# EAGLE design v7-flex2811_16x (EAGLE 7.3.0)

## Sheet 1 of 16
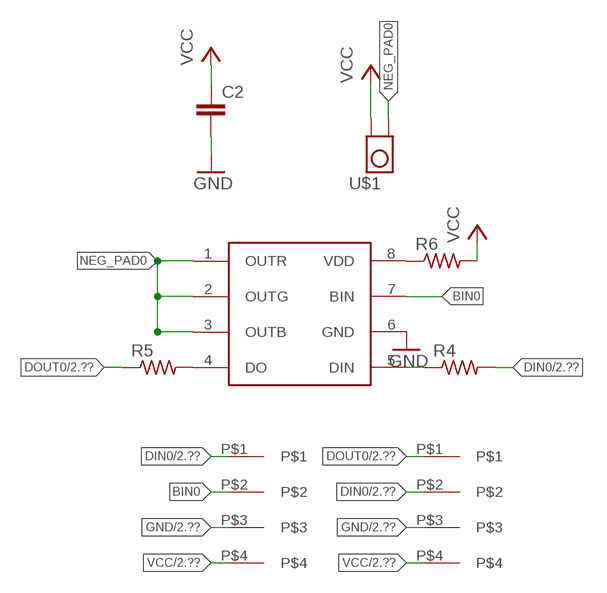
[diagram p0: schematic, sheet 1]

### Parts
C2  C-EUC0201  [C0201]
R4  R-US_R0201  [R0201]
R5  R-US_R0201  [R0201]
R6  R-US_R0201  [R0201]
U$1  TP_4MM_MED_PAD  [TP_4MM_MED_PAD]
U$2  WS2818  [SO08]
U$3  4PAD  [4PAD]
U$4  4PAD  [4PAD]

### Nets
BIN0: U$2.7(BIN) U$3.P$2
DIN0: R4.2 U$3.P$1 U$4.P$2 ; also sheet 2
DOUT0: R5.1 U$4.P$1 ; also sheet 2,3
GND: C2.2 U$2.6(GND) U$3.P$3 U$4.P$3 ; also sheet 2,3,4,5,6,7,8,9,10,11,12,13,14,15,16
N$4: R4.1 U$2.5(DIN)
N$5: R5.2 U$2.4(DO)
N$6: R6.1 U$2.8(VDD)
NEG_PAD0: U$1.P$1 U$2.1(OUTR) U$2.2(OUTG) U$2.3(OUTB)
VCC: C2.1 R6.2 U$1.P$2 U$3.P$4 U$4.P$4 ; also sheet 2,3,4,5,6,7,8,9,10,11,12,13,14,15,16

## Sheet 2 of 16
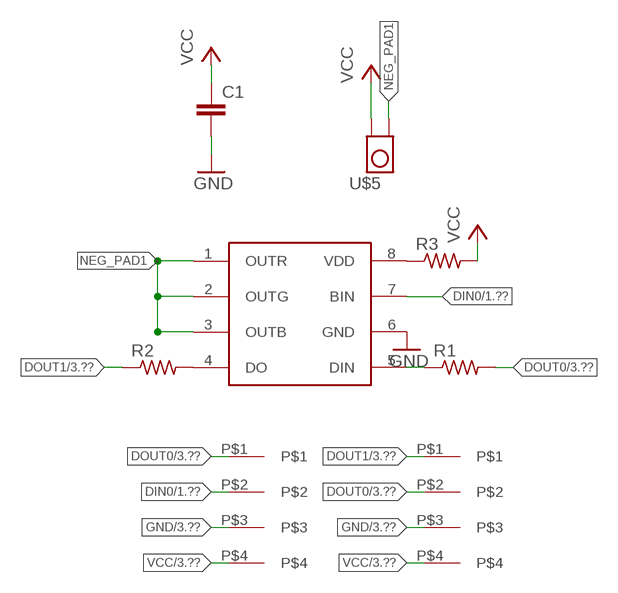
[diagram p1: schematic, sheet 2]

### Parts
C1  C-EUC0201  [C0201]
R1  R-US_R0201  [R0201]
R2  R-US_R0201  [R0201]
R3  R-US_R0201  [R0201]
U$5  TP_4MM_MED_PAD  [TP_4MM_MED_PAD]
U$6  WS2818  [SO08]
U$7  4PAD  [4PAD]
U$8  4PAD  [4PAD]

### Nets
DIN0: U$6.7(BIN) U$7.P$2 ; also sheet 1
DOUT0: R1.2 U$7.P$1 U$8.P$2 ; also sheet 1,3
DOUT1: R2.1 U$8.P$1 ; also sheet 3,4
GND: C1.2 U$6.6(GND) U$7.P$3 U$8.P$3 ; also sheet 1,3,4,5,6,7,8,9,10,11,12,13,14,15,16
N$1: R1.1 U$6.5(DIN)
N$2: R2.2 U$6.4(DO)
N$3: R3.1 U$6.8(VDD)
NEG_PAD1: U$5.P$1 U$6.1(OUTR) U$6.2(OUTG) U$6.3(OUTB)
VCC: C1.1 R3.2 U$5.P$2 U$7.P$4 U$8.P$4 ; also sheet 1,3,4,5,6,7,8,9,10,11,12,13,14,15,16

## Sheet 3 of 16
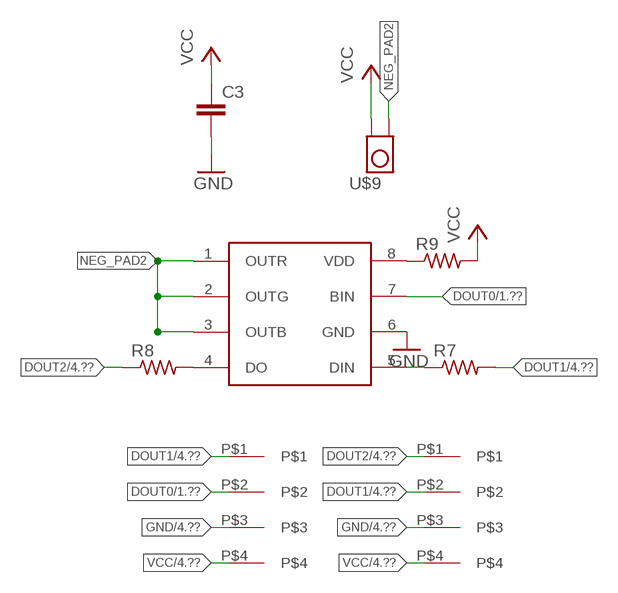
[diagram p2: schematic, sheet 3]

### Parts
C3  C-EUC0201  [C0201]
R7  R-US_R0201  [R0201]
R8  R-US_R0201  [R0201]
R9  R-US_R0201  [R0201]
U$9  TP_4MM_MED_PAD  [TP_4MM_MED_PAD]
U$10  WS2818  [SO08]
U$11  4PAD  [4PAD]
U$12  4PAD  [4PAD]

### Nets
DOUT0: U$10.7(BIN) U$11.P$2 ; also sheet 1,2
DOUT1: R7.2 U$11.P$1 U$12.P$2 ; also sheet 2,4
DOUT2: R8.1 U$12.P$1 ; also sheet 4,5
GND: C3.2 U$10.6(GND) U$11.P$3 U$12.P$3 ; also sheet 1,2,4,5,6,7,8,9,10,11,12,13,14,15,16
N$7: R7.1 U$10.5(DIN)
N$8: R8.2 U$10.4(DO)
N$9: R9.1 U$10.8(VDD)
NEG_PAD2: U$9.P$1 U$10.1(OUTR) U$10.2(OUTG) U$10.3(OUTB)
VCC: C3.1 R9.2 U$9.P$2 U$11.P$4 U$12.P$4 ; also sheet 1,2,4,5,6,7,8,9,10,11,12,13,14,15,16

## Sheet 4 of 16
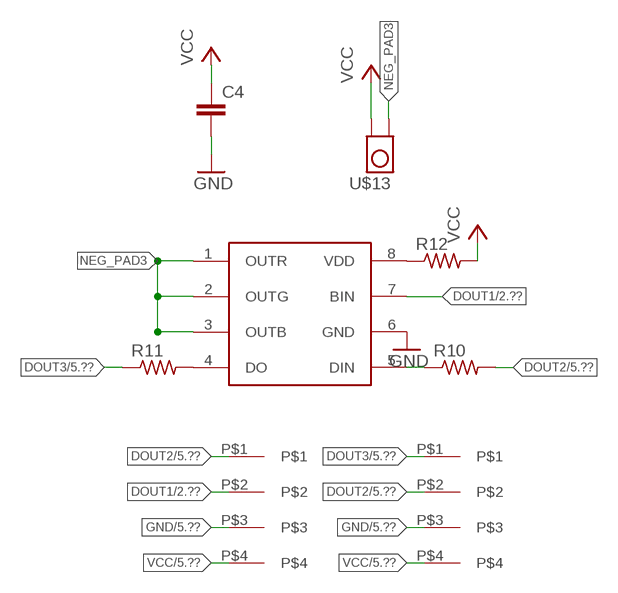
[diagram p3: schematic, sheet 4]

### Parts
C4  C-EUC0201  [C0201]
R10  R-US_R0201  [R0201]
R11  R-US_R0201  [R0201]
R12  R-US_R0201  [R0201]
U$13  TP_4MM_MED_PAD  [TP_4MM_MED_PAD]
U$14  WS2818  [SO08]
U$15  4PAD  [4PAD]
U$16  4PAD  [4PAD]

### Nets
DOUT1: U$14.7(BIN) U$15.P$2 ; also sheet 2,3
DOUT2: R10.2 U$15.P$1 U$16.P$2 ; also sheet 3,5
DOUT3: R11.1 U$16.P$1 ; also sheet 5,6
GND: C4.2 U$14.6(GND) U$15.P$3 U$16.P$3 ; also sheet 1,2,3,5,6,7,8,9,10,11,12,13,14,15,16
N$10: R10.1 U$14.5(DIN)
N$11: R11.2 U$14.4(DO)
N$12: R12.1 U$14.8(VDD)
NEG_PAD3: U$13.P$1 U$14.1(OUTR) U$14.2(OUTG) U$14.3(OUTB)
VCC: C4.1 R12.2 U$13.P$2 U$15.P$4 U$16.P$4 ; also sheet 1,2,3,5,6,7,8,9,10,11,12,13,14,15,16

## Sheet 5 of 16
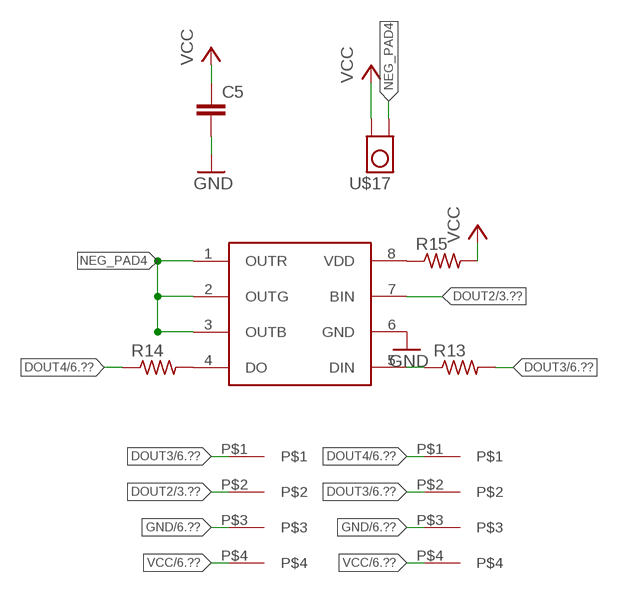
[diagram p4: schematic, sheet 5]

### Parts
C5  C-EUC0201  [C0201]
R13  R-US_R0201  [R0201]
R14  R-US_R0201  [R0201]
R15  R-US_R0201  [R0201]
U$17  TP_4MM_MED_PAD  [TP_4MM_MED_PAD]
U$18  WS2818  [SO08]
U$19  4PAD  [4PAD]
U$20  4PAD  [4PAD]

### Nets
DOUT2: U$18.7(BIN) U$19.P$2 ; also sheet 3,4
DOUT3: R13.2 U$19.P$1 U$20.P$2 ; also sheet 4,6
DOUT4: R14.1 U$20.P$1 ; also sheet 6,7
GND: C5.2 U$18.6(GND) U$19.P$3 U$20.P$3 ; also sheet 1,2,3,4,6,7,8,9,10,11,12,13,14,15,16
N$13: R13.1 U$18.5(DIN)
N$14: R14.2 U$18.4(DO)
N$15: R15.1 U$18.8(VDD)
NEG_PAD4: U$17.P$1 U$18.1(OUTR) U$18.2(OUTG) U$18.3(OUTB)
VCC: C5.1 R15.2 U$17.P$2 U$19.P$4 U$20.P$4 ; also sheet 1,2,3,4,6,7,8,9,10,11,12,13,14,15,16

## Sheet 6 of 16
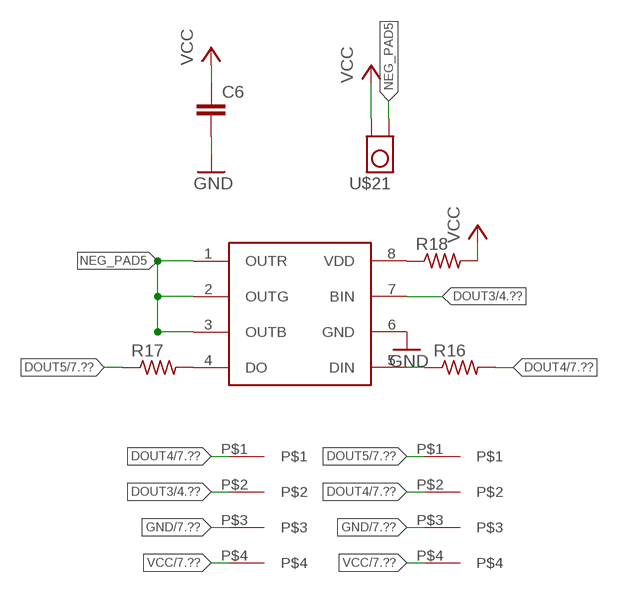
[diagram p5: schematic, sheet 6]

### Parts
C6  C-EUC0201  [C0201]
R16  R-US_R0201  [R0201]
R17  R-US_R0201  [R0201]
R18  R-US_R0201  [R0201]
U$21  TP_4MM_MED_PAD  [TP_4MM_MED_PAD]
U$22  WS2818  [SO08]
U$23  4PAD  [4PAD]
U$24  4PAD  [4PAD]

### Nets
DOUT3: U$22.7(BIN) U$23.P$2 ; also sheet 4,5
DOUT4: R16.2 U$23.P$1 U$24.P$2 ; also sheet 5,7
DOUT5: R17.1 U$24.P$1 ; also sheet 7,8
GND: C6.2 U$22.6(GND) U$23.P$3 U$24.P$3 ; also sheet 1,2,3,4,5,7,8,9,10,11,12,13,14,15,16
N$16: R16.1 U$22.5(DIN)
N$17: R17.2 U$22.4(DO)
N$18: R18.1 U$22.8(VDD)
NEG_PAD5: U$21.P$1 U$22.1(OUTR) U$22.2(OUTG) U$22.3(OUTB)
VCC: C6.1 R18.2 U$21.P$2 U$23.P$4 U$24.P$4 ; also sheet 1,2,3,4,5,7,8,9,10,11,12,13,14,15,16

## Sheet 7 of 16
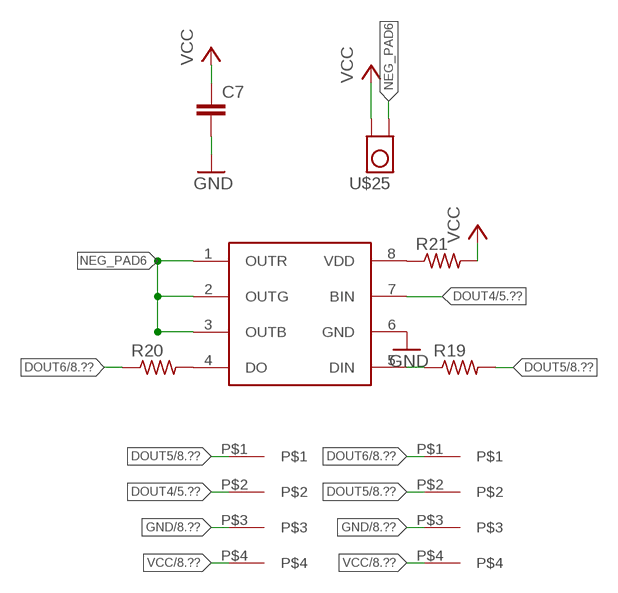
[diagram p6: schematic, sheet 7]

### Parts
C7  C-EUC0201  [C0201]
R19  R-US_R0201  [R0201]
R20  R-US_R0201  [R0201]
R21  R-US_R0201  [R0201]
U$25  TP_4MM_MED_PAD  [TP_4MM_MED_PAD]
U$26  WS2818  [SO08]
U$27  4PAD  [4PAD]
U$28  4PAD  [4PAD]

### Nets
DOUT4: U$26.7(BIN) U$27.P$2 ; also sheet 5,6
DOUT5: R19.2 U$27.P$1 U$28.P$2 ; also sheet 6,8
DOUT6: R20.1 U$28.P$1 ; also sheet 8,9
GND: C7.2 U$26.6(GND) U$27.P$3 U$28.P$3 ; also sheet 1,2,3,4,5,6,8,9,10,11,12,13,14,15,16
N$19: R19.1 U$26.5(DIN)
N$20: R20.2 U$26.4(DO)
N$21: R21.1 U$26.8(VDD)
NEG_PAD6: U$25.P$1 U$26.1(OUTR) U$26.2(OUTG) U$26.3(OUTB)
VCC: C7.1 R21.2 U$25.P$2 U$27.P$4 U$28.P$4 ; also sheet 1,2,3,4,5,6,8,9,10,11,12,13,14,15,16

## Sheet 8 of 16
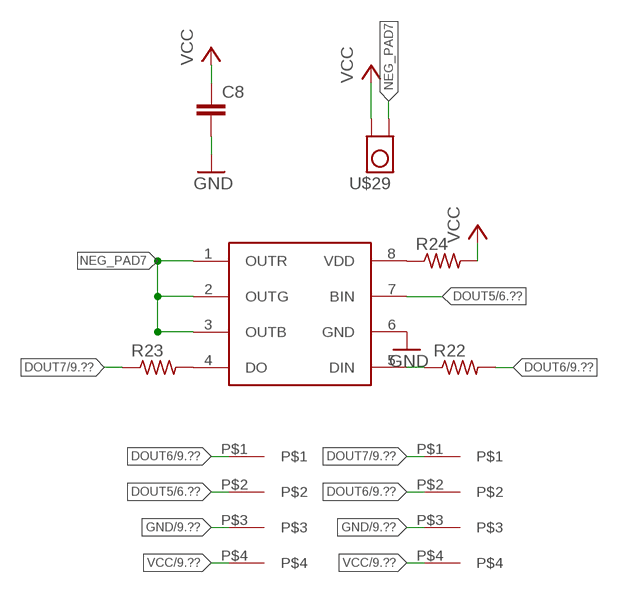
[diagram p7: schematic, sheet 8]

### Parts
C8  C-EUC0201  [C0201]
R22  R-US_R0201  [R0201]
R23  R-US_R0201  [R0201]
R24  R-US_R0201  [R0201]
U$29  TP_4MM_MED_PAD  [TP_4MM_MED_PAD]
U$30  WS2818  [SO08]
U$31  4PAD  [4PAD]
U$32  4PAD  [4PAD]

### Nets
DOUT5: U$30.7(BIN) U$31.P$2 ; also sheet 6,7
DOUT6: R22.2 U$31.P$1 U$32.P$2 ; also sheet 7,9
DOUT7: R23.1 U$32.P$1 ; also sheet 9,10
GND: C8.2 U$30.6(GND) U$31.P$3 U$32.P$3 ; also sheet 1,2,3,4,5,6,7,9,10,11,12,13,14,15,16
N$22: R22.1 U$30.5(DIN)
N$23: R23.2 U$30.4(DO)
N$24: R24.1 U$30.8(VDD)
NEG_PAD7: U$29.P$1 U$30.1(OUTR) U$30.2(OUTG) U$30.3(OUTB)
VCC: C8.1 R24.2 U$29.P$2 U$31.P$4 U$32.P$4 ; also sheet 1,2,3,4,5,6,7,9,10,11,12,13,14,15,16

## Sheet 9 of 16
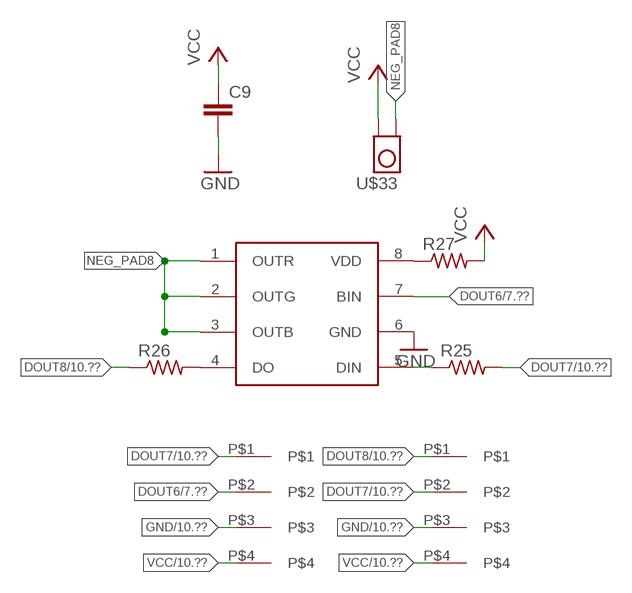
[diagram p8: schematic, sheet 9]

### Parts
C9  C-EUC0201  [C0201]
R25  R-US_R0201  [R0201]
R26  R-US_R0201  [R0201]
R27  R-US_R0201  [R0201]
U$33  TP_4MM_MED_PAD  [TP_4MM_MED_PAD]
U$34  WS2818  [SO08]
U$35  4PAD  [4PAD]
U$36  4PAD  [4PAD]

### Nets
DOUT6: U$34.7(BIN) U$35.P$2 ; also sheet 7,8
DOUT7: R25.2 U$35.P$1 U$36.P$2 ; also sheet 8,10
DOUT8: R26.1 U$36.P$1 ; also sheet 10,11
GND: C9.2 U$34.6(GND) U$35.P$3 U$36.P$3 ; also sheet 1,2,3,4,5,6,7,8,10,11,12,13,14,15,16
N$25: R25.1 U$34.5(DIN)
N$26: R26.2 U$34.4(DO)
N$27: R27.1 U$34.8(VDD)
NEG_PAD8: U$33.P$1 U$34.1(OUTR) U$34.2(OUTG) U$34.3(OUTB)
VCC: C9.1 R27.2 U$33.P$2 U$35.P$4 U$36.P$4 ; also sheet 1,2,3,4,5,6,7,8,10,11,12,13,14,15,16

## Sheet 10 of 16
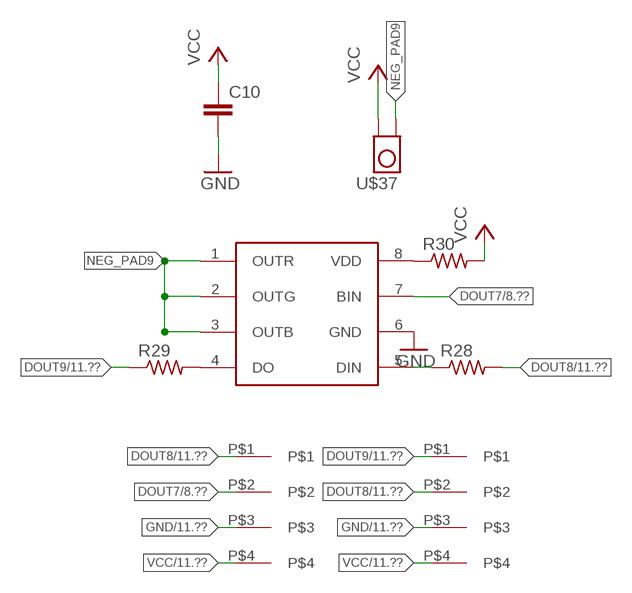
[diagram p9: schematic, sheet 10]

### Parts
C10  C-EUC0201  [C0201]
R28  R-US_R0201  [R0201]
R29  R-US_R0201  [R0201]
R30  R-US_R0201  [R0201]
U$37  TP_4MM_MED_PAD  [TP_4MM_MED_PAD]
U$38  WS2818  [SO08]
U$39  4PAD  [4PAD]
U$40  4PAD  [4PAD]

### Nets
DOUT7: U$38.7(BIN) U$39.P$2 ; also sheet 8,9
DOUT8: R28.2 U$39.P$1 U$40.P$2 ; also sheet 9,11
DOUT9: R29.1 U$40.P$1 ; also sheet 11,12
GND: C10.2 U$38.6(GND) U$39.P$3 U$40.P$3 ; also sheet 1,2,3,4,5,6,7,8,9,11,12,13,14,15,16
N$28: R28.1 U$38.5(DIN)
N$29: R29.2 U$38.4(DO)
N$30: R30.1 U$38.8(VDD)
NEG_PAD9: U$37.P$1 U$38.1(OUTR) U$38.2(OUTG) U$38.3(OUTB)
VCC: C10.1 R30.2 U$37.P$2 U$39.P$4 U$40.P$4 ; also sheet 1,2,3,4,5,6,7,8,9,11,12,13,14,15,16

## Sheet 11 of 16
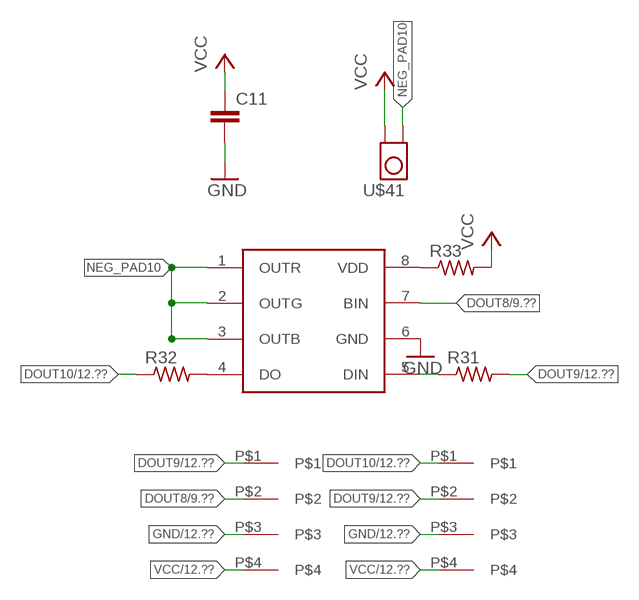
[diagram p10: schematic, sheet 11]

### Parts
C11  C-EUC0201  [C0201]
R31  R-US_R0201  [R0201]
R32  R-US_R0201  [R0201]
R33  R-US_R0201  [R0201]
U$41  TP_4MM_MED_PAD  [TP_4MM_MED_PAD]
U$42  WS2818  [SO08]
U$43  4PAD  [4PAD]
U$44  4PAD  [4PAD]

### Nets
DOUT8: U$42.7(BIN) U$43.P$2 ; also sheet 9,10
DOUT9: R31.2 U$43.P$1 U$44.P$2 ; also sheet 10,12
DOUT10: R32.1 U$44.P$1 ; also sheet 12,13
GND: C11.2 U$42.6(GND) U$43.P$3 U$44.P$3 ; also sheet 1,2,3,4,5,6,7,8,9,10,12,13,14,15,16
N$31: R31.1 U$42.5(DIN)
N$32: R32.2 U$42.4(DO)
N$33: R33.1 U$42.8(VDD)
NEG_PAD10: U$41.P$1 U$42.1(OUTR) U$42.2(OUTG) U$42.3(OUTB)
VCC: C11.1 R33.2 U$41.P$2 U$43.P$4 U$44.P$4 ; also sheet 1,2,3,4,5,6,7,8,9,10,12,13,14,15,16

## Sheet 12 of 16
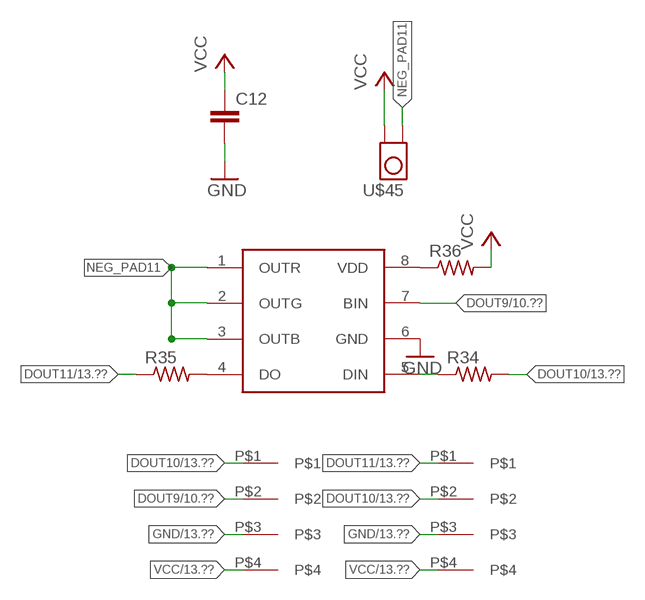
[diagram p11: schematic, sheet 12]

### Parts
C12  C-EUC0201  [C0201]
R34  R-US_R0201  [R0201]
R35  R-US_R0201  [R0201]
R36  R-US_R0201  [R0201]
U$45  TP_4MM_MED_PAD  [TP_4MM_MED_PAD]
U$46  WS2818  [SO08]
U$47  4PAD  [4PAD]
U$48  4PAD  [4PAD]

### Nets
DOUT9: U$46.7(BIN) U$47.P$2 ; also sheet 10,11
DOUT10: R34.2 U$47.P$1 U$48.P$2 ; also sheet 11,13
DOUT11: R35.1 U$48.P$1 ; also sheet 13,14
GND: C12.2 U$46.6(GND) U$47.P$3 U$48.P$3 ; also sheet 1,2,3,4,5,6,7,8,9,10,11,13,14,15,16
N$34: R34.1 U$46.5(DIN)
N$35: R35.2 U$46.4(DO)
N$36: R36.1 U$46.8(VDD)
NEG_PAD11: U$45.P$1 U$46.1(OUTR) U$46.2(OUTG) U$46.3(OUTB)
VCC: C12.1 R36.2 U$45.P$2 U$47.P$4 U$48.P$4 ; also sheet 1,2,3,4,5,6,7,8,9,10,11,13,14,15,16

## Sheet 13 of 16
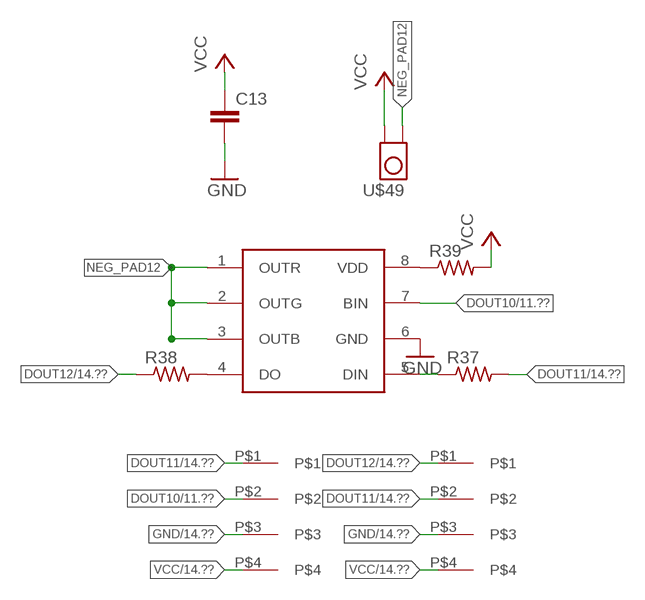
[diagram p12: schematic, sheet 13]

### Parts
C13  C-EUC0201  [C0201]
R37  R-US_R0201  [R0201]
R38  R-US_R0201  [R0201]
R39  R-US_R0201  [R0201]
U$49  TP_4MM_MED_PAD  [TP_4MM_MED_PAD]
U$50  WS2818  [SO08]
U$51  4PAD  [4PAD]
U$52  4PAD  [4PAD]

### Nets
DOUT10: U$50.7(BIN) U$51.P$2 ; also sheet 11,12
DOUT11: R37.2 U$51.P$1 U$52.P$2 ; also sheet 12,14
DOUT12: R38.1 U$52.P$1 ; also sheet 14,15
GND: C13.2 U$50.6(GND) U$51.P$3 U$52.P$3 ; also sheet 1,2,3,4,5,6,7,8,9,10,11,12,14,15,16
N$37: R37.1 U$50.5(DIN)
N$38: R38.2 U$50.4(DO)
N$39: R39.1 U$50.8(VDD)
NEG_PAD12: U$49.P$1 U$50.1(OUTR) U$50.2(OUTG) U$50.3(OUTB)
VCC: C13.1 R39.2 U$49.P$2 U$51.P$4 U$52.P$4 ; also sheet 1,2,3,4,5,6,7,8,9,10,11,12,14,15,16

## Sheet 14 of 16
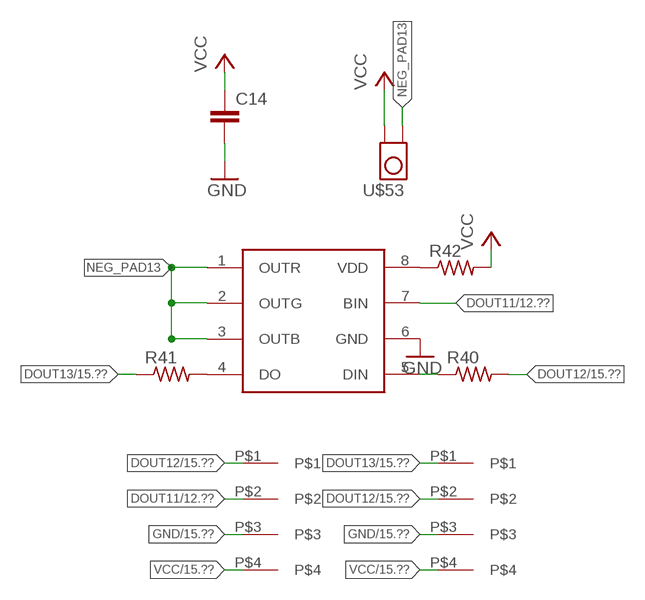
[diagram p13: schematic, sheet 14]

### Parts
C14  C-EUC0201  [C0201]
R40  R-US_R0201  [R0201]
R41  R-US_R0201  [R0201]
R42  R-US_R0201  [R0201]
U$53  TP_4MM_MED_PAD  [TP_4MM_MED_PAD]
U$54  WS2818  [SO08]
U$55  4PAD  [4PAD]
U$56  4PAD  [4PAD]

### Nets
DOUT11: U$54.7(BIN) U$55.P$2 ; also sheet 12,13
DOUT12: R40.2 U$55.P$1 U$56.P$2 ; also sheet 13,15
DOUT13: R41.1 U$56.P$1 ; also sheet 15,16
GND: C14.2 U$54.6(GND) U$55.P$3 U$56.P$3 ; also sheet 1,2,3,4,5,6,7,8,9,10,11,12,13,15,16
N$40: R40.1 U$54.5(DIN)
N$41: R41.2 U$54.4(DO)
N$42: R42.1 U$54.8(VDD)
NEG_PAD13: U$53.P$1 U$54.1(OUTR) U$54.2(OUTG) U$54.3(OUTB)
VCC: C14.1 R42.2 U$53.P$2 U$55.P$4 U$56.P$4 ; also sheet 1,2,3,4,5,6,7,8,9,10,11,12,13,15,16

## Sheet 15 of 16
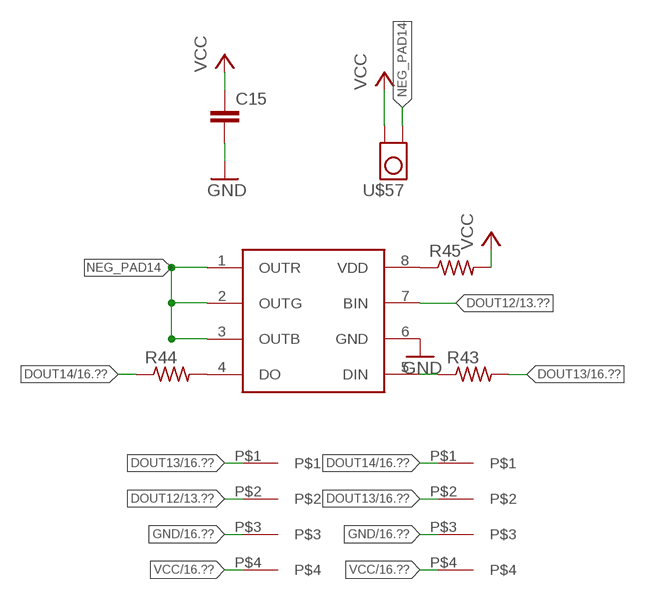
[diagram p14: schematic, sheet 15]

### Parts
C15  C-EUC0201  [C0201]
R43  R-US_R0201  [R0201]
R44  R-US_R0201  [R0201]
R45  R-US_R0201  [R0201]
U$57  TP_4MM_MED_PAD  [TP_4MM_MED_PAD]
U$58  WS2818  [SO08]
U$59  4PAD  [4PAD]
U$60  4PAD  [4PAD]

### Nets
DOUT12: U$58.7(BIN) U$59.P$2 ; also sheet 13,14
DOUT13: R43.2 U$59.P$1 U$60.P$2 ; also sheet 14,16
DOUT14: R44.1 U$60.P$1 ; also sheet 16
GND: C15.2 U$58.6(GND) U$59.P$3 U$60.P$3 ; also sheet 1,2,3,4,5,6,7,8,9,10,11,12,13,14,16
N$43: R43.1 U$58.5(DIN)
N$44: R44.2 U$58.4(DO)
N$45: R45.1 U$58.8(VDD)
NEG_PAD14: U$57.P$1 U$58.1(OUTR) U$58.2(OUTG) U$58.3(OUTB)
VCC: C15.1 R45.2 U$57.P$2 U$59.P$4 U$60.P$4 ; also sheet 1,2,3,4,5,6,7,8,9,10,11,12,13,14,16

## Sheet 16 of 16
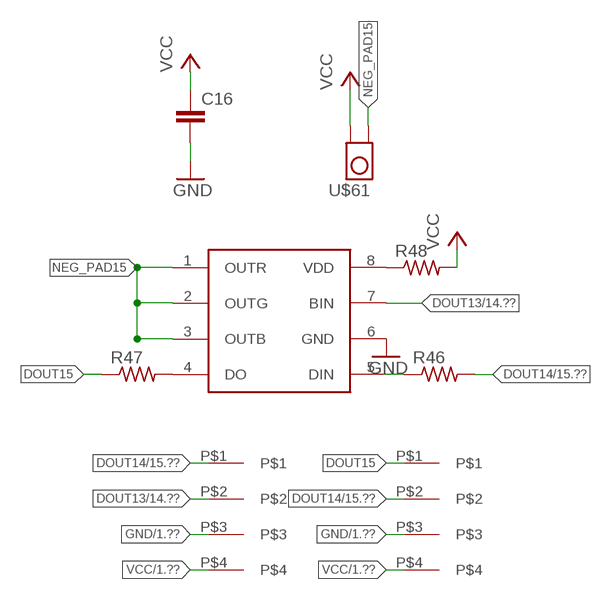
[diagram p15: schematic, sheet 16]

### Parts
C16  C-EUC0201  [C0201]
R46  R-US_R0201  [R0201]
R47  R-US_R0201  [R0201]
R48  R-US_R0201  [R0201]
U$61  TP_4MM_MED_PAD  [TP_4MM_MED_PAD]
U$62  WS2818  [SO08]
U$63  4PAD  [4PAD]
U$64  4PAD  [4PAD]

### Nets
DOUT13: U$62.7(BIN) U$63.P$2 ; also sheet 14,15
DOUT14: R46.2 U$63.P$1 U$64.P$2 ; also sheet 15
DOUT15: R47.1 U$64.P$1
GND: C16.2 U$62.6(GND) U$63.P$3 U$64.P$3 ; also sheet 1,2,3,4,5,6,7,8,9,10,11,12,13,14,15
N$46: R46.1 U$62.5(DIN)
N$47: R47.2 U$62.4(DO)
N$48: R48.1 U$62.8(VDD)
NEG_PAD15: U$61.P$1 U$62.1(OUTR) U$62.2(OUTG) U$62.3(OUTB)
VCC: C16.1 R48.2 U$61.P$2 U$63.P$4 U$64.P$4 ; also sheet 1,2,3,4,5,6,7,8,9,10,11,12,13,14,15

## Library data of the parts
C1-C16 = rcl:C-EU: CAPACITOR, European symbol
R1-R48 = rcl:R-US_: RESISTOR, American symbol
U$1 U$5 U$9 U$13 U$17 U$21 U$25 U$29 U$33 U$37 U$41 U$45 U$49 U$53 U$57 U$61 = tom-tappytap-v5-flex:TP_4MM_MED_PAD
U$2 U$6 U$10 U$14 U$18 U$22 U$26 U$30 U$34 U$38 U$42 U$46 U$50 U$54 U$58 U$62 = Sparky:WS2818
U$3 U$4 U$7 U$8 U$11 U$12 U$15 U$16 U$19 U$20 U$23 U$24 U$27 U$28 U$31 U$32 U$35 U$36 U$39 U$40 U$43 U$44 U$47 U$48 U$51 U$52 U$55 U$56 U$59 U$60 U$63 U$64 = Sparky:4PAD

## Board
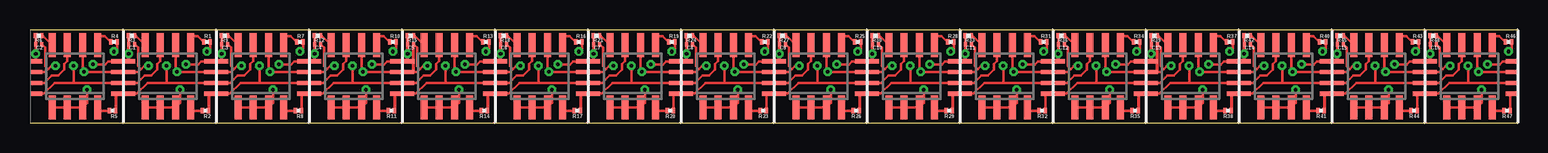
[diagram p16: board, top side]
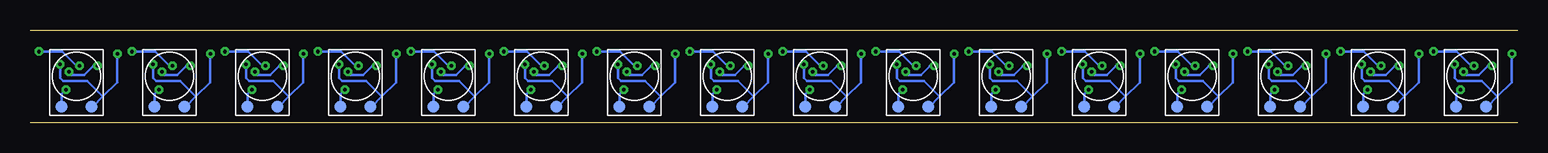
[diagram p17: board, bottom side, seen from below]

Size 124 x 7.75 mm. Coordinates in mm from the lower left corner, seen from the top.
Outline: 0,0 124,0
Outline: 124,7.75 0,7.75
Copper layers (1*16): Top 0.035mm / dielectric 1.5mm / Bottom 0.035mm
Design rules "default": minimum track width 10mil, minimum drill 24mil, track to track 8mil, track to pad 8mil, pad to pad 8mil, via to via 8mil, smd to smd 8mil, copper to edge 40mil, drill to drill 8mil, minimum pad ring 10mil, minimum via ring 8mil, stop-mask expansion 4mil, vias tented up to drill 0mil, thermal gap 10mil

### Footprints (pad centres in the part's own frame; a part is rotated, then mirrored left to right if it is on the bottom)
C0201 = smd 0.25 x 0.35: 1 -0.25,0; 2 0.25,0
R0201 = smd 0.28 x 0.43: 1 -0.255,0; 2 0.255,0
TP_4MM_MED_PAD = smd 1.016 x 1.016: P$1 -1.24,-2.55; P$2 1.24,-2.55
SO08 = smd 0.6 x 2: 1 -1.905,-2.6; 2 -0.635,-2.6; 3 0.635,-2.6; 4 1.905,-2.6; 5 1.905,2.6; 6 0.635,2.6; 7 -0.635,2.6; 8 -1.905,2.6
4PAD = smd 1 x 0.4: P$1 0,0.3 | smd 1 x 0.35: P$2 0,1.2; P$3 0,2.1; P$4 0,3

### Placement (x,y rotation side)
C1  8.47,6.55 0 top
C2  0.72,6.55 0 top
C3  16.23,6.55 0 top
C4  23.98,6.55 0 top
C5  31.73,6.55 0 top
C6  39.48,6.55 0 top
C7  47.23,6.55 0 top
C8  54.98,6.55 0 top
C9  62.73,6.55 0 top
C10  70.47,6.55 0 top
C11  78.22,6.55 0 top
C12  85.97,6.55 0 top
C13  93.72,6.55 0 top
C14  101.47,6.55 0 top
C15  109.22,6.55 0 top
C16  116.97,6.55 0 top
R1  14.75,6.75 0 top
R2  14.62,1 180 top
R3  8.47,7.28 180 top
R4  7,6.75 0 top
R5  6.88,1 180 top
R6  0.72,7.28 180 top
R7  22.5,6.75 0 top
R8  22.38,1 180 top
R9  16.23,7.28 180 top
R10  30.25,6.75 0 top
R11  30.12,1 180 top
R12  23.98,7.28 180 top
R13  38,6.75 0 top
R14  37.88,1 180 top
R15  31.73,7.28 180 top
R16  45.75,6.75 0 top
R17  45.62,1 180 top
R18  39.48,7.28 180 top
R19  53.5,6.75 0 top
R20  53.38,1 180 top
R21  47.23,7.28 180 top
R22  61.25,6.75 0 top
R23  61.12,1 180 top
R24  54.98,7.28 180 top
R25  69,6.75 0 top
R26  68.88,1 180 top
R27  62.73,7.28 180 top
R28  76.75,6.75 0 top
R29  76.62,1 180 top
R30  70.47,7.28 180 top
R31  84.5,6.75 0 top
R32  84.38,1 180 top
R33  78.22,7.28 180 top
R34  92.25,6.75 0 top
R35  92.12,1 180 top
R36  85.97,7.28 180 top
R37  100,6.75 0 top
R38  99.88,1 180 top
R39  93.72,7.28 180 top
R40  107.75,6.75 0 top
R41  107.62,1 180 top
R42  101.47,7.28 180 top
R43  115.5,6.75 0 top
R44  115.38,1 180 top
R45  109.22,7.28 180 top
R46  123.25,6.75 0 top
R47  123.12,1 180 top
R48  116.97,7.28 180 top
U$1  3.88,3.88 0 bottom
U$2  3.75,3.88 0 top
U$3  0.5,2.12 0 top
U$4  7.25,2.12 0 top
U$5  11.62,3.88 0 bottom
U$6  11.5,3.88 0 top
U$7  8.25,2.12 0 top
U$8  15,2.12 0 top
U$9  19.38,3.88 0 bottom
U$10  19.25,3.88 0 top
U$11  16,2.12 0 top
U$12  22.75,2.12 0 top
U$13  27.12,3.88 0 bottom
U$14  27,3.88 0 top
U$15  23.75,2.12 0 top
U$16  30.5,2.12 0 top
U$17  34.88,3.88 0 bottom
U$18  34.75,3.88 0 top
U$19  31.5,2.12 0 top
U$20  38.25,2.12 0 top
U$21  42.62,3.88 0 bottom
U$22  42.5,3.88 0 top
U$23  39.25,2.12 0 top
U$24  46,2.12 0 top
U$25  50.38,3.88 0 bottom
U$26  50.25,3.88 0 top
U$27  47,2.12 0 top
U$28  53.75,2.12 0 top
U$29  58.12,3.88 0 bottom
U$30  58,3.88 0 top
U$31  54.75,2.12 0 top
U$32  61.5,2.12 0 top
U$33  65.88,3.88 0 bottom
U$34  65.75,3.88 0 top
U$35  62.5,2.12 0 top
U$36  69.25,2.12 0 top
U$37  73.62,3.88 0 bottom
U$38  73.5,3.88 0 top
U$39  70.25,2.12 0 top
U$40  77,2.12 0 top
U$41  81.38,3.88 0 bottom
U$42  81.25,3.88 0 top
U$43  78,2.12 0 top
U$44  84.75,2.12 0 top
U$45  89.12,3.88 0 bottom
U$46  89,3.88 0 top
U$47  85.75,2.12 0 top
U$48  92.5,2.12 0 top
U$49  96.88,3.88 0 bottom
U$50  96.75,3.88 0 top
U$51  93.5,2.12 0 top
U$52  100.25,2.12 0 top
U$53  104.62,3.88 0 bottom
U$54  104.5,3.88 0 top
U$55  101.25,2.12 0 top
U$56  108,2.12 0 top
U$57  112.38,3.88 0 bottom
U$58  112.25,3.88 0 top
U$59  109,2.12 0 top
U$60  115.75,2.12 0 top
U$61  120.12,3.88 0 bottom
U$62  120,3.88 0 top
U$63  116.75,2.12 0 top
U$64  123.5,2.12 0 top

### Tracks (layer width: path | path; a pad name or v marks a point on that pad's centre or on a via)
BIN0
  Top 0.2: U$3.P$2 1.2,3.33 1.8,3.93 2.35,3.93 2.87,4.45 2.87,4.89 3.12,5.13 U$2.7
DIN0  (via drill 0.3)
  Top 0.2: 3.62,3.33 v3.62,4.75 | R4.2 7.25,6.2 v7,5.94 | U$3.P$1 1.17,2.42 2.06,3.33 3.62,3.33 | 3.62,3.33 U$4.P$2 | U$7.P$2 8.95,3.33 9.55,3.93 10.1,3.93 10.62,4.45 10.62,4.89 10.87,5.13 U$6.7
  Top 0.254: U$7.P$2 U$4.P$2
  Bottom 0.2: v3.62,4.75 3.88,4.75 5.07,5.94 v7,5.94
DOUT0  (via drill 0.3)
  Top 0.2: R5.1 7.13,2.31 U$4.P$1 | 11.38,3.33 v11.38,4.75 | R1.2 15.01,6.2 v14.75,5.94 | U$7.P$1 8.91,2.42 9.81,3.33 11.38,3.33 | 11.38,3.33 U$8.P$2 | U$11.P$2 16.7,3.33 17.3,3.93 17.85,3.93 18.37,4.45 18.37,4.89 18.61,5.13 U$10.7 18.62,6.46
  Top 0.254: U$7.P$1 7.13,2.42 R5.1 | U$11.P$2 U$8.P$2
  Bottom 0.2: v11.38,4.75 11.62,4.75 12.81,5.94 v14.75,5.94
DOUT1  (via drill 0.3)
  Top 0.2: R2.1 14.88,2.31 U$8.P$1 | 19.12,3.33 v19.12,4.75 | R7.2 22.75,6.2 v22.5,5.94 | U$11.P$1 16.66,2.42 17.57,3.33 19.12,3.33 | 19.12,3.33 U$12.P$2 | U$15.P$2 24.45,3.33 25.05,3.93 25.6,3.93 26.12,4.45 26.12,4.89 26.36,5.13 U$14.7 26.38,6.46
  Top 0.254: U$11.P$1 14.88,2.42 R2.1 | U$15.P$2 U$12.P$2
  Bottom 0.2: v19.12,4.75 19.38,4.75 20.57,5.94 v22.5,5.94
DOUT2  (via drill 0.3)
  Top 0.2: R8.1 22.63,2.31 U$12.P$1 | 26.88,3.33 v26.88,4.75 | R10.2 30.5,6.2 v30.25,5.94 | U$15.P$1 24.41,2.42 25.32,3.33 26.88,3.33 | 26.88,3.33 U$16.P$2 | U$19.P$2 32.2,3.33 32.8,3.93 33.35,3.93 33.87,4.45 33.87,4.89 34.12,5.13 U$18.7
  Top 0.254: U$12.P$1 U$15.P$1 | U$16.P$2 U$19.P$2
  Bottom 0.2: v26.88,4.75 27.12,4.75 28.32,5.94 v30.25,5.94
DOUT3  (via drill 0.3)
  Top 0.2: R11.1 30.38,2.31 U$16.P$1 | 34.62,3.33 v34.62,4.75 | R13.2 38.26,6.2 v38,5.94 | U$19.P$1 32.16,2.42 33.06,3.33 34.62,3.33 | 34.62,3.33 U$20.P$2 | U$23.P$2 39.95,3.33 40.55,3.93 41.1,3.93 41.62,4.45 41.62,4.89 41.87,5.13 U$22.7
  Top 0.254: U$23.P$2 U$20.P$2 | U$19.P$1 30.38,2.42 R11.1
  Bottom 0.2: v34.62,4.75 34.88,4.75 36.06,5.94 v38,5.94
DOUT4  (via drill 0.3)
  Top 0.2: R14.1 38.13,2.31 U$20.P$1 | 42.38,3.33 v42.38,4.75 | R16.2 46.01,6.2 v45.75,5.94 | U$23.P$1 39.91,2.42 40.81,3.33 42.38,3.33 | 42.38,3.33 U$24.P$2 | U$27.P$2 47.7,3.33 48.3,3.93 48.85,3.93 49.37,4.45 49.37,4.89 49.62,5.13 U$26.7
  Top 0.254: U$23.P$1 38.13,2.42 R14.1 | U$27.P$2 U$24.P$2
  Bottom 0.2: v42.38,4.75 42.62,4.75 43.81,5.94 v45.75,5.94
DOUT5  (via drill 0.3)
  Top 0.2: R17.1 45.88,2.31 U$24.P$1 | 50.12,3.33 v50.12,4.75 | R19.2 53.76,6.2 v53.5,5.94 | U$27.P$1 47.66,2.42 48.56,3.33 50.12,3.33 | 50.12,3.33 U$28.P$2 | U$31.P$2 55.45,3.33 56.05,3.93 56.6,3.93 57.12,4.45 57.12,4.89 57.37,5.13 U$30.7
  Top 0.254: U$27.P$1 45.88,2.42 R17.1 | U$31.P$2 U$28.P$2
  Bottom 0.2: v50.12,4.75 50.38,4.75 51.56,5.94 v53.5,5.94
DOUT6  (via drill 0.3)
  Top 0.2: R20.1 53.63,2.31 U$28.P$1 | 57.88,3.33 v57.88,4.75 | R22.2 61.51,6.2 v61.25,5.94 | U$31.P$1 55.41,2.42 56.31,3.33 57.88,3.33 | 57.88,3.33 U$32.P$2 | U$35.P$2 63.2,3.33 63.8,3.93 64.35,3.93 64.87,4.45 64.87,4.89 65.11,5.13 U$34.7 65.12,6.46
  Top 0.254: U$28.P$1 U$31.P$1 | U$32.P$2 U$35.P$2
  Bottom 0.2: v57.88,4.75 58.12,4.75 59.31,5.94 v61.25,5.94
DOUT7  (via drill 0.3)
  Top 0.2: R23.1 61.38,2.31 U$32.P$1 | 65.62,3.33 v65.62,4.75 | R25.2 69.25,6.2 v69,5.94 | U$35.P$1 63.16,2.42 64.06,3.33 65.62,3.33 | 65.62,3.33 U$36.P$2 | U$39.P$2 70.95,3.33 71.56,3.93 72.1,3.93 72.62,4.45 72.62,4.89 72.86,5.13 U$38.7 72.88,6.46
  Top 0.254: U$39.P$2 U$36.P$2 | U$32.P$1 U$35.P$1
  Bottom 0.2: v65.62,4.75 65.88,4.75 67.06,5.94 v69,5.94
DOUT8  (via drill 0.3)
  Top 0.2: R26.1 69.13,2.31 U$36.P$1 | 73.38,3.33 v73.38,4.75 | R28.2 77,6.2 v76.75,5.94 | U$39.P$1 70.92,2.42 71.81,3.33 73.38,3.33 | 73.38,3.33 U$40.P$2 | U$43.P$2 78.7,3.33 79.31,3.93 79.85,3.93 80.37,4.45 80.37,4.89 80.61,5.13 U$42.7 80.62,6.46
  Top 0.254: U$39.P$1 69.13,2.42 R26.1 | U$43.P$2 U$40.P$2
  Bottom 0.2: v73.38,4.75 73.62,4.75 74.81,5.94 v76.75,5.94
DOUT9  (via drill 0.3)
  Top 0.2: R29.1 76.88,2.31 U$40.P$1 | 81.12,3.33 v81.12,4.75 | R31.2 84.75,6.2 v84.5,5.94 | U$43.P$1 78.67,2.42 79.56,3.33 81.12,3.33 | 81.12,3.33 U$44.P$2 | U$47.P$2 86.45,3.33 87.06,3.93 87.6,3.93 88.12,4.45 88.12,4.89 88.36,5.13 U$46.7 88.38,6.46
  Top 0.254: U$43.P$1 76.88,2.42 R29.1 | U$47.P$2 U$44.P$2
  Bottom 0.2: v81.12,4.75 81.38,4.75 82.56,5.94 v84.5,5.94
DOUT10  (via drill 0.3)
  Top 0.2: R32.1 84.63,2.31 U$44.P$1 | 88.88,3.33 v88.88,4.75 | R34.2 92.5,6.2 v92.25,5.94 | U$47.P$1 86.42,2.42 87.31,3.33 88.88,3.33 | 88.88,3.33 U$48.P$2 | U$51.P$2 94.2,3.33 94.81,3.93 95.35,3.93 95.87,4.45 95.87,4.89 96.11,5.13 U$50.7 96.12,6.46
  Top 0.254: U$44.P$1 U$47.P$1 | U$48.P$2 U$51.P$2
  Bottom 0.2: v88.88,4.75 89.12,4.75 90.31,5.94 v92.25,5.94
DOUT11  (via drill 0.3)
  Top 0.2: R35.1 92.38,2.31 U$48.P$1 | 96.62,3.33 v96.62,4.75 | R37.2 100.25,6.2 v100,5.94 | U$51.P$1 94.17,2.42 95.06,3.33 96.62,3.33 | 96.62,3.33 U$52.P$2 | U$55.P$2 101.95,3.33 102.56,3.93 103.1,3.93 103.62,4.45 103.62,4.89 103.86,5.13 U$54.7 103.88,6.46
  Top 0.254: U$55.P$2 U$52.P$2 | U$51.P$1 92.38,2.42 R35.1
  Bottom 0.2: v96.62,4.75 96.88,4.75 98.06,5.94 v100,5.94
DOUT12  (via drill 0.3)
  Top 0.2: R38.1 100.13,2.31 U$52.P$1 | 104.38,3.33 v104.38,4.75 | R40.2 108,6.2 v107.75,5.94 | U$55.P$1 101.92,2.42 102.81,3.33 104.38,3.33 | 104.38,3.33 U$56.P$2 | U$59.P$2 109.7,3.33 110.31,3.93 110.85,3.93 111.37,4.45 111.37,4.89 111.61,5.13 U$58.7 111.62,6.46
  Top 0.254: U$55.P$1 100.13,2.42 R38.1 | U$59.P$2 U$56.P$2
  Bottom 0.2: v104.38,4.75 104.62,4.75 105.81,5.94 v107.75,5.94
DOUT13  (via drill 0.3)
  Top 0.2: R41.1 107.88,2.31 U$56.P$1 | 112.12,3.33 v112.12,4.75 | R43.2 115.75,6.2 v115.5,5.94 | U$59.P$1 109.67,2.42 110.56,3.33 112.12,3.33 | 112.12,3.33 U$60.P$2 | U$63.P$2 117.45,3.33 118.06,3.93 118.6,3.93 119.12,4.45 119.12,4.89 119.36,5.13 U$62.7 119.38,6.46
  Top 0.254: U$59.P$1 107.88,2.42 R41.1 | U$63.P$2 U$60.P$2
  Bottom 0.2: v112.12,4.75 112.38,4.75 113.56,5.94 v115.5,5.94
DOUT14  (via drill 0.3)
  Top 0.2: R44.1 115.63,2.31 U$60.P$1 | 119.88,3.33 v119.88,4.75 | R46.2 123.5,6.2 v123.25,5.94 | U$63.P$1 117.42,2.42 118.31,3.33 119.88,3.33 | 119.88,3.33 U$64.P$2
  Top 0.254: U$60.P$1 U$63.P$1
  Bottom 0.2: v119.88,4.75 120.12,4.75 121.31,5.94 v123.25,5.94
DOUT15
  Top 0.2: R47.1 123.38,2.31 U$64.P$1
GND  (via drill 0.3)
  Top 0.2: U$2.6 4.38,4.37 v4.5,4.25 4.53,4.22 U$4.P$3 7.22,4.25 | U$3.P$3 0.85,4.22 0.88,4.25 1.25,4.25 1.5,4.5 | 1.5,4.5 1.75,4.75 v2.12,4.75 | 1.5,4.5 1.27,4.73 1.27,6.25 C2.2 | U$6.6 12.13,4.37 v12.25,4.25 12.28,4.22 U$8.P$3 14.97,4.25 | U$7.P$3 8.6,4.22 8.62,4.25 9,4.25 9.25,4.5 | 9.25,4.5 9.5,4.75 v9.88,4.75 | 9.25,4.5 9.02,4.73 9.02,6.25 C1.2 | U$10.6 19.89,4.37 v20,4.25 20.02,4.22 U$12.P$3 22.73,4.25 | U$11.P$3 16.35,4.22 16.38,4.25 16.75,4.25 17,4.5 | 17,4.5 17.25,4.75 v17.62,4.75 | 17,4.5 16.77,4.73 16.77,6.25 C3.2 | U$14.6 27.64,4.37 v27.75,4.25 27.77,4.22 U$16.P$3 30.48,4.25 | U$15.P$3 24.1,4.22 24.12,4.25 24.5,4.25 24.75,4.5 | 24.75,4.5 25,4.75 v25.38,4.75 | 24.75,4.5 24.52,4.73 24.52,6.25 C4.2 | U$18.6 35.38,4.37 v35.5,4.25 35.52,4.22 U$20.P$3 38.23,4.25 | U$19.P$3 31.85,4.22 31.88,4.25 32.25,4.25 32.5,4.5 | 32.5,4.5 32.75,4.75 v33.12,4.75 | 32.5,4.5 32.27,4.73 32.27,6.25 C5.2 | U$22.6 43.13,4.37 v43.25,4.25 43.27,4.22 U$24.P$3 45.98,4.25 | U$23.P$3 39.6,4.22 39.62,4.25 40,4.25 40.25,4.5 | 40.25,4.5 40.5,4.75 v40.88,4.75 | 40.25,4.5 40.02,4.73 40.02,6.25 C6.2 | U$26.6 50.88,4.37 v51,4.25 51.02,4.22 U$28.P$3 53.73,4.25 | U$27.P$3 47.35,4.22 47.38,4.25 47.75,4.25 48,4.5 | 48,4.5 48.25,4.75 v48.62,4.75 | 48,4.5 47.77,4.73 47.77,6.25 C7.2 | U$30.6 58.63,4.37 v58.75,4.25 58.77,4.22 U$32.P$3 61.48,4.25 | U$31.P$3 55.1,4.22 55.12,4.25 55.5,4.25 55.75,4.5 | 55.75,4.5 56,4.75 v56.38,4.75 | 55.75,4.5 55.52,4.73 55.52,6.25 C8.2 | U$34.6 66.39,4.37 v66.5,4.25 66.53,4.22 U$36.P$3 69.22,4.25 | U$35.P$3 62.85,4.22 62.88,4.25 63.25,4.25 63.5,4.5 | 63.5,4.5 63.75,4.75 v64.12,4.75 | 63.5,4.5 63.27,4.73 63.27,6.25 C9.2
  Top 0.2: U$38.6 74.14,4.37 v74.25,4.25 74.28,4.22 U$40.P$3 76.97,4.25 | U$39.P$3 70.6,4.22 70.62,4.25 71,4.25 71.25,4.5 | 71.25,4.5 71.5,4.75 v71.88,4.75 | 71.25,4.5 71.02,4.73 71.02,6.25 C10.2 | U$42.6 81.89,4.37 v82,4.25 82.03,4.22 U$44.P$3 84.72,4.25 | U$43.P$3 78.35,4.22 78.38,4.25 78.75,4.25 79,4.5 | 79,4.5 79.25,4.75 v79.62,4.75 | 79,4.5 78.77,4.73 78.77,6.25 C11.2 | U$46.6 89.64,4.37 v89.75,4.25 89.78,4.22 U$48.P$3 92.47,4.25 | U$47.P$3 86.1,4.22 86.12,4.25 86.5,4.25 86.75,4.5 | 86.75,4.5 87,4.75 v87.38,4.75 | 86.75,4.5 86.52,4.73 86.52,6.25 C12.2 | U$50.6 97.39,4.37 v97.5,4.25 97.53,4.22 U$52.P$3 100.22,4.25 | U$51.P$3 93.85,4.22 93.88,4.25 94.25,4.25 94.5,4.5 | 94.5,4.5 94.75,4.75 v95.12,4.75 | 94.5,4.5 94.27,4.73 94.27,6.25 C13.2 | U$54.6 105.14,4.37 v105.25,4.25 105.28,4.22 U$56.P$3 107.97,4.25 | U$55.P$3 101.6,4.22 101.62,4.25 102,4.25 102.25,4.5 | 102.25,4.5 102.5,4.75 v102.88,4.75 | 102.25,4.5 102.02,4.73 102.02,6.25 C14.2 | U$58.6 112.89,4.37 v113,4.25 113.03,4.22 U$60.P$3 115.72,4.25 | U$59.P$3 109.35,4.22 109.38,4.25 109.75,4.25 110,4.5 | 110,4.5 110.25,4.75 v110.62,4.75 | 110,4.5 109.77,4.73 109.77,6.25 C15.2 | U$62.6 120.64,4.37 v120.75,4.25 120.78,4.22 U$64.P$3 123.47,4.25 | U$63.P$3 117.1,4.22 117.12,4.25 117.5,4.25 117.75,4.5 | 117.75,4.5 118,4.75 v118.38,4.75 | 117.75,4.5 117.52,4.73 117.52,6.25 C16.2
  Top 0.254: U$7.P$3 U$4.P$3 | U$11.P$3 U$8.P$3 | U$15.P$3 U$12.P$3 | U$23.P$3 U$20.P$3 | U$27.P$3 U$24.P$3 | U$31.P$3 U$28.P$3 | U$16.P$3 31.98,4.22 C5.2 | U$39.P$3 U$36.P$3 | U$43.P$3 U$40.P$3 | U$47.P$3 U$44.P$3 | U$55.P$3 U$52.P$3 | U$59.P$3 U$56.P$3 | U$63.P$3 U$60.P$3 | U$48.P$3 93.97,4.22 C13.2 | U$35.P$3 U$32.P$3
  Bottom 0.2: v4.5,4.25 4.5,4 3.25,4 2.5,4.75 v2.12,4.75 | v12.25,4.25 12.25,4 11,4 10.25,4.75 v9.88,4.75 | v20,4.25 20,4 18.75,4 18,4.75 v17.62,4.75 | v27.75,4.25 27.75,4 26.5,4 25.75,4.75 v25.38,4.75 | v35.5,4.25 35.5,4 34.25,4 33.5,4.75 v33.12,4.75 | v43.25,4.25 43.25,4 42,4 41.25,4.75 v40.88,4.75 | v51,4.25 51,4 49.75,4 49,4.75 v48.62,4.75 | v58.75,4.25 58.75,4 57.5,4 56.75,4.75 v56.38,4.75 | v66.5,4.25 66.5,4 65.25,4 64.5,4.75 v64.12,4.75 | v74.25,4.25 74.25,4 73,4 72.25,4.75 v71.88,4.75 | v82,4.25 82,4 80.75,4 80,4.75 v79.62,4.75 | v89.75,4.25 89.75,4 88.5,4 87.75,4.75 v87.38,4.75 | v97.5,4.25 97.5,4 96.25,4 95.5,4.75 v95.12,4.75 | v105.25,4.25 105.25,4 104,4 103.25,4.75 v102.88,4.75 | v113,4.25 113,4 111.75,4 111,4.75 v110.62,4.75 | v120.75,4.25 120.75,4 119.5,4 118.75,4.75 v118.38,4.75
N$1
  Top 0.2: 13.4,6.78 U$6.5 13.38,6.5 13.38,7 13.62,7.25 13.99,7.25 R1.1
N$2
  Top 0.2: U$6.4 13.68,1 R2.2
N$3
  Top 0.2: 9.6,6.78 U$6.8 8.79,7.28 R3.1
N$4
  Top 0.2: 5.66,6.78 U$2.5 5.62,6.5 5.62,7 5.88,7.25 6.25,7.25 R4.1
N$5
  Top 0.2: U$2.4 5.93,1 R5.2
N$6
  Top 0.2: 1.84,6.78 U$2.8 1.04,7.28 R6.1
N$7
  Top 0.2: 21.16,6.78 U$10.5 21.12,6.5 21.12,7 21.38,7.25 21.75,7.25 R7.1
N$8
  Top 0.2: U$10.4 21.43,1 R8.2
N$9
  Top 0.2: 17.34,6.78 U$10.8 16.55,7.28 R9.1
N$10
  Top 0.2: 28.91,6.78 U$14.5 28.88,6.5 28.88,7 29.12,7.25 29.5,7.25 R10.1
N$11
  Top 0.2: U$14.4 29.18,1 R11.2
N$12
  Top 0.2: 25.09,6.78 U$14.8 24.3,7.28 R12.1
N$13
  Top 0.2: 36.66,6.78 U$18.5 36.62,6.5 36.62,7 36.88,7.25 37.24,7.25 R13.1
N$14
  Top 0.2: U$18.4 36.93,1 R14.2
N$15
  Top 0.2: 32.84,6.78 U$18.8 32.05,7.28 R15.1
N$16
  Top 0.2: 44.41,6.78 U$22.5 44.38,6.5 44.38,7 44.62,7.25 44.99,7.25 R16.1
N$17
  Top 0.2: U$22.4 44.68,1 R17.2
N$18
  Top 0.2: 40.59,6.78 U$22.8 39.8,7.28 R18.1
N$19
  Top 0.2: 52.16,6.78 U$26.5 52.12,6.5 52.12,7 52.38,7.25 52.74,7.25 R19.1
N$20
  Top 0.2: U$26.4 52.43,1 R20.2
N$21
  Top 0.2: 48.34,6.78 U$26.8 47.55,7.28 R21.1
N$22
  Top 0.2: 59.91,6.78 U$30.5 59.88,6.5 59.88,7 60.12,7.25 60.49,7.25 R22.1
N$23
  Top 0.2: U$30.4 60.18,1 R23.2
N$24
  Top 0.2: 56.09,6.78 U$30.8 55.3,7.28 R24.1
N$25
  Top 0.2: 67.66,6.78 U$34.5 67.62,6.5 67.62,7 67.88,7.25 68.25,7.25 R25.1
N$26
  Top 0.2: U$34.4 67.93,1 R26.2
N$27
  Top 0.2: 63.84,6.78 U$34.8 63.05,7.28 R27.1
N$28
  Top 0.2: 75.41,6.78 U$38.5 75.38,6.5 75.38,7 75.62,7.25 76,7.25 R28.1
N$29
  Top 0.2: U$38.4 75.68,1 R29.2
N$30
  Top 0.2: 71.59,6.78 U$38.8 70.8,7.28 R30.1
N$31
  Top 0.2: 83.16,6.78 U$42.5 83.12,6.5 83.12,7 83.38,7.25 83.75,7.25 R31.1
N$32
  Top 0.2: U$42.4 83.43,1 R32.2
N$33
  Top 0.2: 79.34,6.78 U$42.8 78.55,7.28 R33.1
N$34
  Top 0.2: 90.91,6.78 U$46.5 90.88,6.5 90.88,7 91.12,7.25 91.5,7.25 R34.1
N$35
  Top 0.2: U$46.4 91.18,1 R35.2
N$36
  Top 0.2: 87.09,6.78 U$46.8 86.3,7.28 R36.1
N$37
  Top 0.2: 98.66,6.78 U$50.5 98.62,6.5 98.62,7 98.88,7.25 99.25,7.25 R37.1
N$38
  Top 0.2: U$50.4 98.93,1 R38.2
N$39
  Top 0.2: 94.84,6.78 U$50.8 94.05,7.28 R39.1
N$40
  Top 0.2: 106.41,6.78 U$54.5 106.38,6.5 106.38,7 106.62,7.25 107,7.25 R40.1
N$41
  Top 0.2: U$54.4 106.68,1 R41.2
N$42
  Top 0.2: 102.59,6.78 U$54.8 101.8,7.28 R42.1
N$43
  Top 0.2: 114.16,6.78 U$58.5 114.12,6.5 114.12,7 114.38,7.25 114.75,7.25 R43.1
N$44
  Top 0.2: U$58.4 114.43,1 R44.2
N$45
  Top 0.2: 110.34,6.78 U$58.8 109.55,7.28 R45.1
N$46
  Top 0.2: 121.91,6.78 U$62.5 121.88,6.5 121.88,7 122.12,7.25 122.5,7.25 R46.1
N$47
  Top 0.2: U$62.4 122.18,1 R47.2
N$48
  Top 0.2: 118.09,6.78 U$62.8 117.3,7.28 R48.1
NEG_PAD0  (via drill 0.3)
  Top 0.2: U$2.1 U$2.2 U$2.3 4.75,1.64 v4.75,2.75
  Bottom 0.2: v4.75,2.75 5.12,2.38 U$1.P$1
NEG_PAD1  (via drill 0.3)
  Top 0.2: U$6.1 U$6.2 U$6.3 12.5,1.64 v12.5,2.75
  Bottom 0.2: v12.5,2.75 12.87,2.38 U$5.P$1
NEG_PAD2  (via drill 0.3)
  Top 0.2: U$10.1 U$10.2 U$10.3 20.25,1.64 v20.25,2.75
  Bottom 0.2: v20.25,2.75 20.61,2.38 U$9.P$1
NEG_PAD3  (via drill 0.3)
  Top 0.2: U$14.1 U$14.2 U$14.3 28,1.64 v28,2.75
  Bottom 0.2: v28,2.75 28.36,2.38 U$13.P$1
NEG_PAD4  (via drill 0.3)
  Top 0.2: U$18.1 U$18.2 U$18.3 35.75,1.64 v35.75,2.75
  Bottom 0.2: v35.75,2.75 36.12,2.38 U$17.P$1
NEG_PAD5  (via drill 0.3)
  Top 0.2: U$22.1 U$22.2 U$22.3 43.5,1.64 v43.5,2.75
  Bottom 0.2: v43.5,2.75 43.87,2.38 U$21.P$1
NEG_PAD6  (via drill 0.3)
  Top 0.2: U$26.1 U$26.2 U$26.3 51.25,1.64 v51.25,2.75
  Bottom 0.2: v51.25,2.75 51.62,2.38 U$25.P$1
NEG_PAD7  (via drill 0.3)
  Top 0.2: U$30.1 U$30.2 U$30.3 59,1.64 v59,2.75
  Bottom 0.2: v59,2.75 59.37,2.38 U$29.P$1
NEG_PAD8  (via drill 0.3)
  Top 0.2: U$34.1 U$34.2 U$34.3 66.75,1.64 v66.75,2.75
  Bottom 0.2: v66.75,2.75 67.11,2.38 U$33.P$1
NEG_PAD9  (via drill 0.3)
  Top 0.2: U$38.1 U$38.2 U$38.3 74.5,1.64 v74.5,2.75
  Bottom 0.2: v74.5,2.75 74.86,2.38 U$37.P$1
NEG_PAD10  (via drill 0.3)
  Top 0.2: U$42.1 U$42.2 U$42.3 82.25,1.64 v82.25,2.75
  Bottom 0.2: v82.25,2.75 82.61,2.38 U$41.P$1
NEG_PAD11  (via drill 0.3)
  Top 0.2: U$46.1 U$46.2 U$46.3 90,1.64 v90,2.75
  Bottom 0.2: v90,2.75 90.36,2.38 U$45.P$1
NEG_PAD12  (via drill 0.3)
  Top 0.2: U$50.1 U$50.2 U$50.3 97.75,1.64 v97.75,2.75
  Bottom 0.2: v97.75,2.75 98.11,2.38 U$49.P$1
NEG_PAD13  (via drill 0.3)
  Top 0.2: U$54.1 U$54.2 U$54.3 105.5,1.64 v105.5,2.75
  Bottom 0.2: v105.5,2.75 105.86,2.38 U$53.P$1
NEG_PAD14  (via drill 0.3)
  Top 0.2: U$58.1 U$58.2 U$58.3 113.25,1.64 v113.25,2.75
  Bottom 0.2: v113.25,2.75 113.61,2.38 U$57.P$1
NEG_PAD15  (via drill 0.3)
  Top 0.2: U$62.1 U$62.2 U$62.3 121,1.64 v121,2.75
  Bottom 0.2: v121,2.75 121.36,2.38 U$61.P$1
VCC  (via drill 0.3)
  Top 0.2: v5.25,4.88 6.25,4.88 6.5,5.12 U$4.P$4 | U$3.P$4 0.47,5.15 v0.47,5.75 C2.1 0.47,6.66 R6.2 | v13,4.88 14,4.88 14.25,5.12 U$8.P$4 | U$7.P$4 8.22,5.15 v8.22,5.75 C1.1 8.22,6.66 R3.2 | v20.75,4.88 21.75,4.88 22,5.12 U$12.P$4 | U$11.P$4 15.97,5.15 v15.97,5.75 C3.1 15.97,6.66 R9.2 | v28.5,4.88 29.5,4.88 29.75,5.12 U$16.P$4 | U$15.P$4 23.73,5.15 v23.73,5.75 C4.1 23.72,6.66 R12.2 | v36.25,4.88 37.25,4.88 37.5,5.12 U$20.P$4 | U$19.P$4 31.48,5.15 v31.48,5.75 C5.1 31.47,6.66 R15.2 | v44,4.88 45,4.88 45.25,5.12 U$24.P$4 | U$23.P$4 39.23,5.15 v39.23,5.75 C6.1 39.22,6.66 R18.2 | v51.75,4.88 52.75,4.88 53,5.12 U$28.P$4 | U$27.P$4 46.98,5.15 v46.98,5.75 C7.1 46.97,6.66 R21.2 | v59.5,4.88 60.5,4.88 60.75,5.12 U$32.P$4 | U$31.P$4 54.73,5.15 v54.73,5.75 C8.1 54.72,6.66 R24.2 | v67.25,4.88 68.25,4.88 68.5,5.12 U$36.P$4 | U$35.P$4 62.48,5.15 v62.48,5.75 C9.1 62.47,6.66 R27.2 | v75,4.88 76,4.88 76.25,5.12 U$40.P$4 | U$39.P$4 70.22,5.15 v70.22,5.75 C10.1 70.22,6.66 R30.2 | v82.75,4.88 83.75,4.88 84,5.12 U$44.P$4 | U$43.P$4 77.97,5.15 v77.97,5.75 C11.1 77.97,6.66 R33.2 | v90.5,4.88 91.5,4.88 91.75,5.12 U$48.P$4 | U$47.P$4 85.72,5.15 v85.72,5.75 C12.1 85.72,6.66 R36.2 | v98.25,4.88 99.25,4.88 99.5,5.12 U$52.P$4 | U$51.P$4 93.47,5.15 v93.47,5.75 C13.1 93.47,6.66 R39.2 | v106,4.88 107,4.88 107.25,5.12 U$56.P$4 | U$55.P$4 101.22,5.15 v101.22,5.75 C14.1 101.22,6.66 R42.2 | v113.75,4.88 114.75,4.88 115,5.12 U$60.P$4 | U$59.P$4 108.97,5.15 v108.97,5.75 C15.1 108.97,6.66 R45.2 | v121.5,4.88 122.5,4.88 122.75,5.12 U$64.P$4 | U$63.P$4 116.72,5.15 v116.72,5.75 C16.1 116.72,6.66 R48.2
  Top 0.254: U$4.P$4 8.22,5.12 R3.2 | 15.97,5.15 15,5.15 U$8.P$4 | 23.73,5.15 22.77,5.15 U$12.P$4 | U$20.P$4 39.22,5.12 R18.2 | 46.98,5.15 46,5.15 U$24.P$4 | 54.73,5.15 53.77,5.15 U$28.P$4 | U$16.P$4 31.47,5.12 R15.2 | U$36.P$4 70.22,5.12 R30.2 | 77.97,5.15 77,5.15 U$40.P$4 | 85.72,5.15 84.78,5.15 U$44.P$4 | U$52.P$4 101.22,5.12 R42.2 | 108.97,5.15 108,5.15 U$56.P$4 | 116.72,5.15 115.78,5.15 U$60.P$4 | U$48.P$4 93.47,5.12 R39.2 | U$32.P$4 62.47,5.12 R27.2
  Bottom 0.2: v5.25,4.88 5.25,3.75 5,3.5 3,3.5 1.67,2.17 | v0.47,5.75 0.47,3.36 1.67,2.17 | 1.67,2.17 2.51,1.32 U$1.P$2 | v13,4.88 13,3.75 12.75,3.5 10.75,3.5 9.42,2.17 | v8.22,5.75 8.22,3.36 9.42,2.17 | 9.42,2.17 10.26,1.32 U$5.P$2 | v20.75,4.88 20.75,3.75 20.5,3.5 18.5,3.5 17.17,2.17 | v15.97,5.75 15.97,3.36 17.17,2.17 | 17.17,2.17 18.01,1.32 U$9.P$2 | v28.5,4.88 28.5,3.75 28.25,3.5 26.25,3.5 24.92,2.17 | v23.73,5.75 23.73,3.36 24.92,2.17 | 24.92,2.17 25.76,1.32 U$13.P$2 | v36.25,4.88 36.25,3.75 36,3.5 34,3.5 32.67,2.17 | v31.48,5.75 31.48,3.36 32.67,2.17 | 32.67,2.17 33.51,1.32 U$17.P$2 | v44,4.88 44,3.75 43.75,3.5 41.75,3.5 40.42,2.17 | v39.23,5.75 39.23,3.36 40.42,2.17 | 40.42,2.17 41.26,1.32 U$21.P$2 | v51.75,4.88 51.75,3.75 51.5,3.5 49.5,3.5 48.17,2.17 | v46.98,5.75 46.98,3.36 48.17,2.17 | 48.17,2.17 49.01,1.32 U$25.P$2 | v59.5,4.88 59.5,3.75 59.25,3.5 57.25,3.5 55.92,2.17 | v54.73,5.75 54.73,3.36 55.92,2.17 | 55.92,2.17 56.76,1.32 U$29.P$2 | v67.25,4.88 67.25,3.75 67,3.5 65,3.5 63.67,2.17 | v62.48,5.75 62.48,3.36 63.67,2.17 | 63.67,2.17 64.51,1.32 U$33.P$2 | v75,4.88 75,3.75 74.75,3.5 72.75,3.5 71.42,2.17 | v70.22,5.75 70.22,3.36 71.42,2.17 | 71.42,2.17 72.26,1.32 U$37.P$2 | v82.75,4.88 82.75,3.75 82.5,3.5 80.5,3.5 79.17,2.17 | v77.97,5.75 77.97,3.36 79.17,2.17 | 79.17,2.17 80.01,1.32 U$41.P$2 | v90.5,4.88 90.5,3.75 90.25,3.5 88.25,3.5 86.92,2.17 | v85.72,5.75 85.72,3.36 86.92,2.17 | 86.92,2.17 87.76,1.32 U$45.P$2 | v98.25,4.88 98.25,3.75 98,3.5 96,3.5 94.67,2.17 | v93.47,5.75 93.47,3.36 94.67,2.17 | 94.67,2.17 95.51,1.32 U$49.P$2 | v106,4.88 106,3.75 105.75,3.5 103.75,3.5 102.42,2.17 | v101.22,5.75 101.22,3.36 102.42,2.17
  Bottom 0.2: 102.42,2.17 103.26,1.32 U$53.P$2 | v113.75,4.88 113.75,3.75 113.5,3.5 111.5,3.5 110.17,2.17 | v108.97,5.75 108.97,3.36 110.17,2.17 | 110.17,2.17 111.01,1.32 U$57.P$2 | v121.5,4.88 121.5,3.75 121.25,3.5 119.25,3.5 117.92,2.17 | v116.72,5.75 116.72,3.36 117.92,2.17 | 117.92,2.17 118.76,1.32 U$61.P$2